# Altium schematic sheet A_Input.SchDoc
size A; SheetNumber: 5; SheetTotal: 9
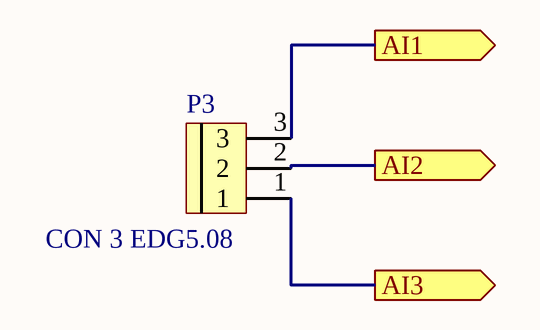
[diagram p0: A_Input.SchDoc]

## Parts
P3  CON 3 EDG5.08  [CON 3 3EDG5.08]

## Ports
AI1 (out), AI2 (out), AI3 (out)

## Nets
AI1: P3.3 ; port AI1
AI2: P3.2 ; port AI2
AI3: P3.1 ; port AI3

## Library data of the parts
P3 = CON 3 EDG5.08: Cắm; Ten_Linh_Kien: CON 3 2EDG5.08-3P 5.08MM ( Xanh Cong); Ma_Hang: MH000760; Ghi_Chu: *; Kieu_Chan: *; Don_Vi: Con; Chung_Loai: Cắm